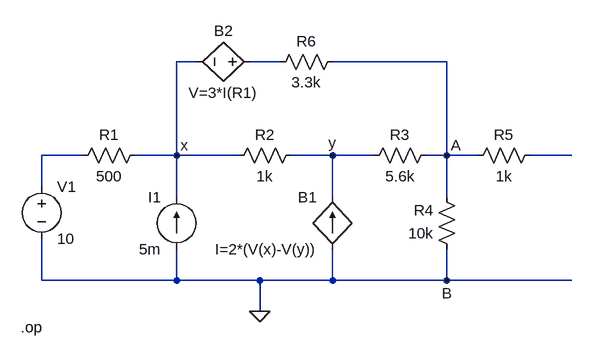
[diagram p0: schematic Circuit_5.asc]
Circuit_5.asc, the LTspice schematic file:
Version 4
SHEET 1 880 680
WIRE 272 -48 240 -48
WIRE 400 -48 352 -48
WIRE 656 -48 480 -48
WIRE 96 96 32 96
WIRE 240 96 240 -48
WIRE 240 96 176 96
WIRE 336 96 240 96
WIRE 480 96 416 96
WIRE 544 96 480 96
WIRE 656 96 656 -48
WIRE 656 96 624 96
WIRE 704 96 656 96
WIRE 848 96 784 96
WIRE 32 144 32 96
WIRE 240 160 240 96
WIRE 480 160 480 96
WIRE 656 160 656 96
WIRE 32 288 32 224
WIRE 240 288 240 240
WIRE 240 288 32 288
WIRE 368 288 240 288
WIRE 480 288 480 240
WIRE 480 288 368 288
WIRE 656 288 656 240
WIRE 656 288 480 288
WIRE 848 288 656 288
WIRE 368 336 368 288
FLAG 240 96 x
FLAG 480 96 y
FLAG 656 96 A
FLAG 656 288 B
FLAG 368 336 0
SYMBOL voltage 32 128 R0
SYMATTR InstName V1
SYMATTR Value 10
SYMBOL res 192 80 R90
WINDOW 0 0 56 VBottom 2
WINDOW 3 32 56 VTop 2
SYMATTR InstName R1
SYMATTR Value 500
SYMBOL res 320 112 R270
WINDOW 0 32 56 VTop 2
WINDOW 3 0 56 VBottom 2
SYMATTR InstName R2
SYMATTR Value 1k
SYMBOL res 384 -32 R270
WINDOW 0 32 56 VTop 2
WINDOW 3 0 56 VBottom 2
SYMATTR InstName R6
SYMATTR Value 3.3k
SYMBOL res 640 80 R90
WINDOW 0 0 56 VBottom 2
WINDOW 3 32 56 VTop 2
SYMATTR InstName R3
SYMATTR Value 5.6k
SYMBOL res 672 256 R180
WINDOW 0 36 76 Left 2
WINDOW 3 36 40 Left 2
SYMATTR InstName R4
SYMATTR Value 10k
SYMBOL current 240 240 R180
WINDOW 0 24 80 Left 2
WINDOW 3 24 0 Left 2
SYMATTR InstName I1
SYMATTR Value 5m
SYMBOL bi 480 240 R180
WINDOW 0 24 80 Left 2
WINDOW 3 24 0 Left 2
SYMATTR InstName B1
SYMATTR Value I=2*(V(x)-V(y))
SYMBOL bv 368 -48 R90
WINDOW 0 -32 56 VBottom 2
WINDOW 3 32 56 VTop 2
SYMATTR InstName B2
SYMATTR Value V=3*I(R1)
SYMBOL res 800 80 R90
WINDOW 0 0 56 VBottom 2
WINDOW 3 32 56 VTop 2
SYMATTR InstName R5
SYMATTR Value 1k
TEXT 0 360 Left 2 !.op

The netlist it stands for:
* Circuit_5.asc
V1 N002 0 10
R1 x N002 500
R2 x y 1k
R6 N001 A 3.3k
R3 A y 5.6k
R4 0 A 10k
I1 0 x 5m
B1 0 y I=2*(V(x)-V(y))
B2 N001 x V=3*I(R1)
R5 N003 A 1k
.op
.backanno
.end